# Altium schematic sheet LoudnessControl.SchDoc
size A4; SheetNumber: 2; SheetTotal: 4
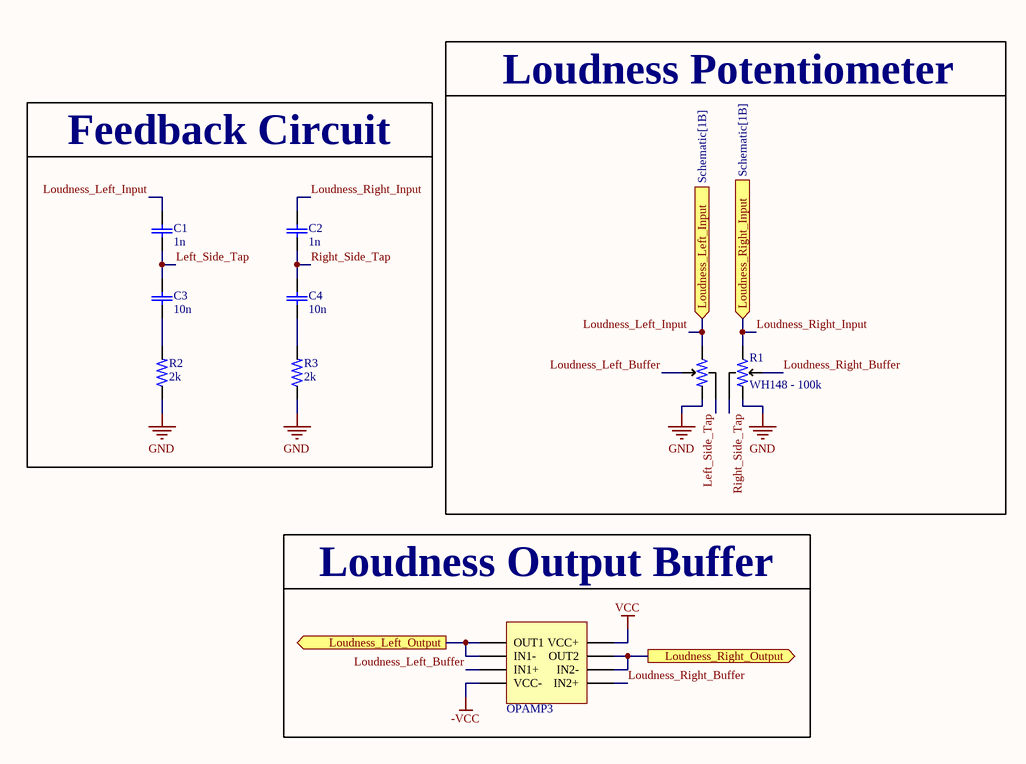
[diagram p0: LoudnessControl.SchDoc]

## Parts
C1  1n  [CERAMIC0603]
C2  1n  [CERAMIC0603]
C3  10n  [CERAMIC0603]
C4  10n  [CERAMIC0603]
OPAMP3  TL072  [DIP8]  (value not drawn)
R1  WH148 - 100k  [WH148]
R2  2k  [RES0603]
R3  2k  [RES0603]

## Ports
Loudness_Left_Input (in, see Schematic[1B]), Loudness_Left_Output (out, see Schematic[2B]), Loudness_Right_Input (in, see Schematic[1B]), Loudness_Right_Output (out, see Schematic[2B])

## Nets
-VCC: OPAMP3.4(VCC-)
GND: R1.3 R1.7 R2.1 R3.1
VCC: OPAMP3.8(VCC+)
Left_Side_Tap: C1.1(C1) C3.2(C2) R1.8
Loudness_Left_Buffer: OPAMP3.3(IN1+) R1.6
Loudness_Left_Input: C1.2(C2) R1.5 ; port Loudness_Left_Input
Loudness_Left_Output: OPAMP3.1(OUT1) OPAMP3.2(IN1-) ; port Loudness_Left_Output
Loudness_Right_Buffer: OPAMP3.5(IN2+) R1.2
Loudness_Right_Input: C2.2(C2) R1.1 ; port Loudness_Right_Input
Loudness_Right_Output: OPAMP3.6(IN2-) OPAMP3.7(OUT2) ; port Loudness_Right_Output
Right_Side_Tap: C2.1(C1) C4.2(C2) R1.4
NetC3_1: C3.1(C1) R2.2
NetC4_1: C4.1(C1) R3.2

## Notes on the sheet
- Feedback Circuit
- Loudness Potentiometer
- Loudness Output Buffer

## Library data of the parts
C1-C4 = Cap: MF: KEMET; MP: TAJC226M025RNJ; SnapEDA_Link: https://www.snapeda.com/parts/TAJC226M025RNJ/KEMET/view-part/?ref=snap; Availability: In Stock; Price: None; Purchase-URL: https://pricing.snapeda.com/search/part/TAJC226M025RNJ/?ref=eda; Package: None; Check_prices: https://www.snapeda.com/parts/TAJC226M025RNJ/KEMET/view-part/?ref=eda; Value: *
R1 = WH148
R2 R3 = RESISTOR SMD: MP: 3-1879460-6; Package: None; Price: None; Value: *; Availability: Unavailable